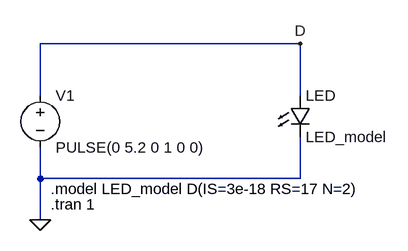
[diagram p0: schematic example_led.asc]
example_led.asc, the LTspice schematic file:
Version 4
SHEET 1 880 680
WIRE 416 64 16 64
WIRE 16 144 16 64
WIRE 416 144 416 64
WIRE 16 272 16 224
WIRE 416 272 416 208
WIRE 416 272 16 272
WIRE 16 336 16 272
FLAG 16 336 0
FLAG 416 64 D
SYMBOL voltage 16 128 R0
WINDOW 123 0 0 Left 0
WINDOW 39 0 0 Left 0
SYMATTR InstName V1
SYMATTR Value PULSE(0 5.2 0 1 0 0)
SYMBOL LED 400 144 R0
SYMATTR InstName LED
SYMATTR Value LED_model
TEXT 32 288 Left 2 !.model LED_model D(IS=3e-18 RS=17 N=2)
TEXT 32 312 Left 2 !.tran 1

The netlist it stands for:
* example_led.asc
V1 D 0 PULSE(0 5.2 0 1 0 0)
D§LED D 0 LED_model
.model D D
.lib standard.dio
.model LED_model D(IS=3e-18 RS=17 N=2)
.tran 1
.backanno
.end